# EAGLE design entity_module (EAGLE 6.3)
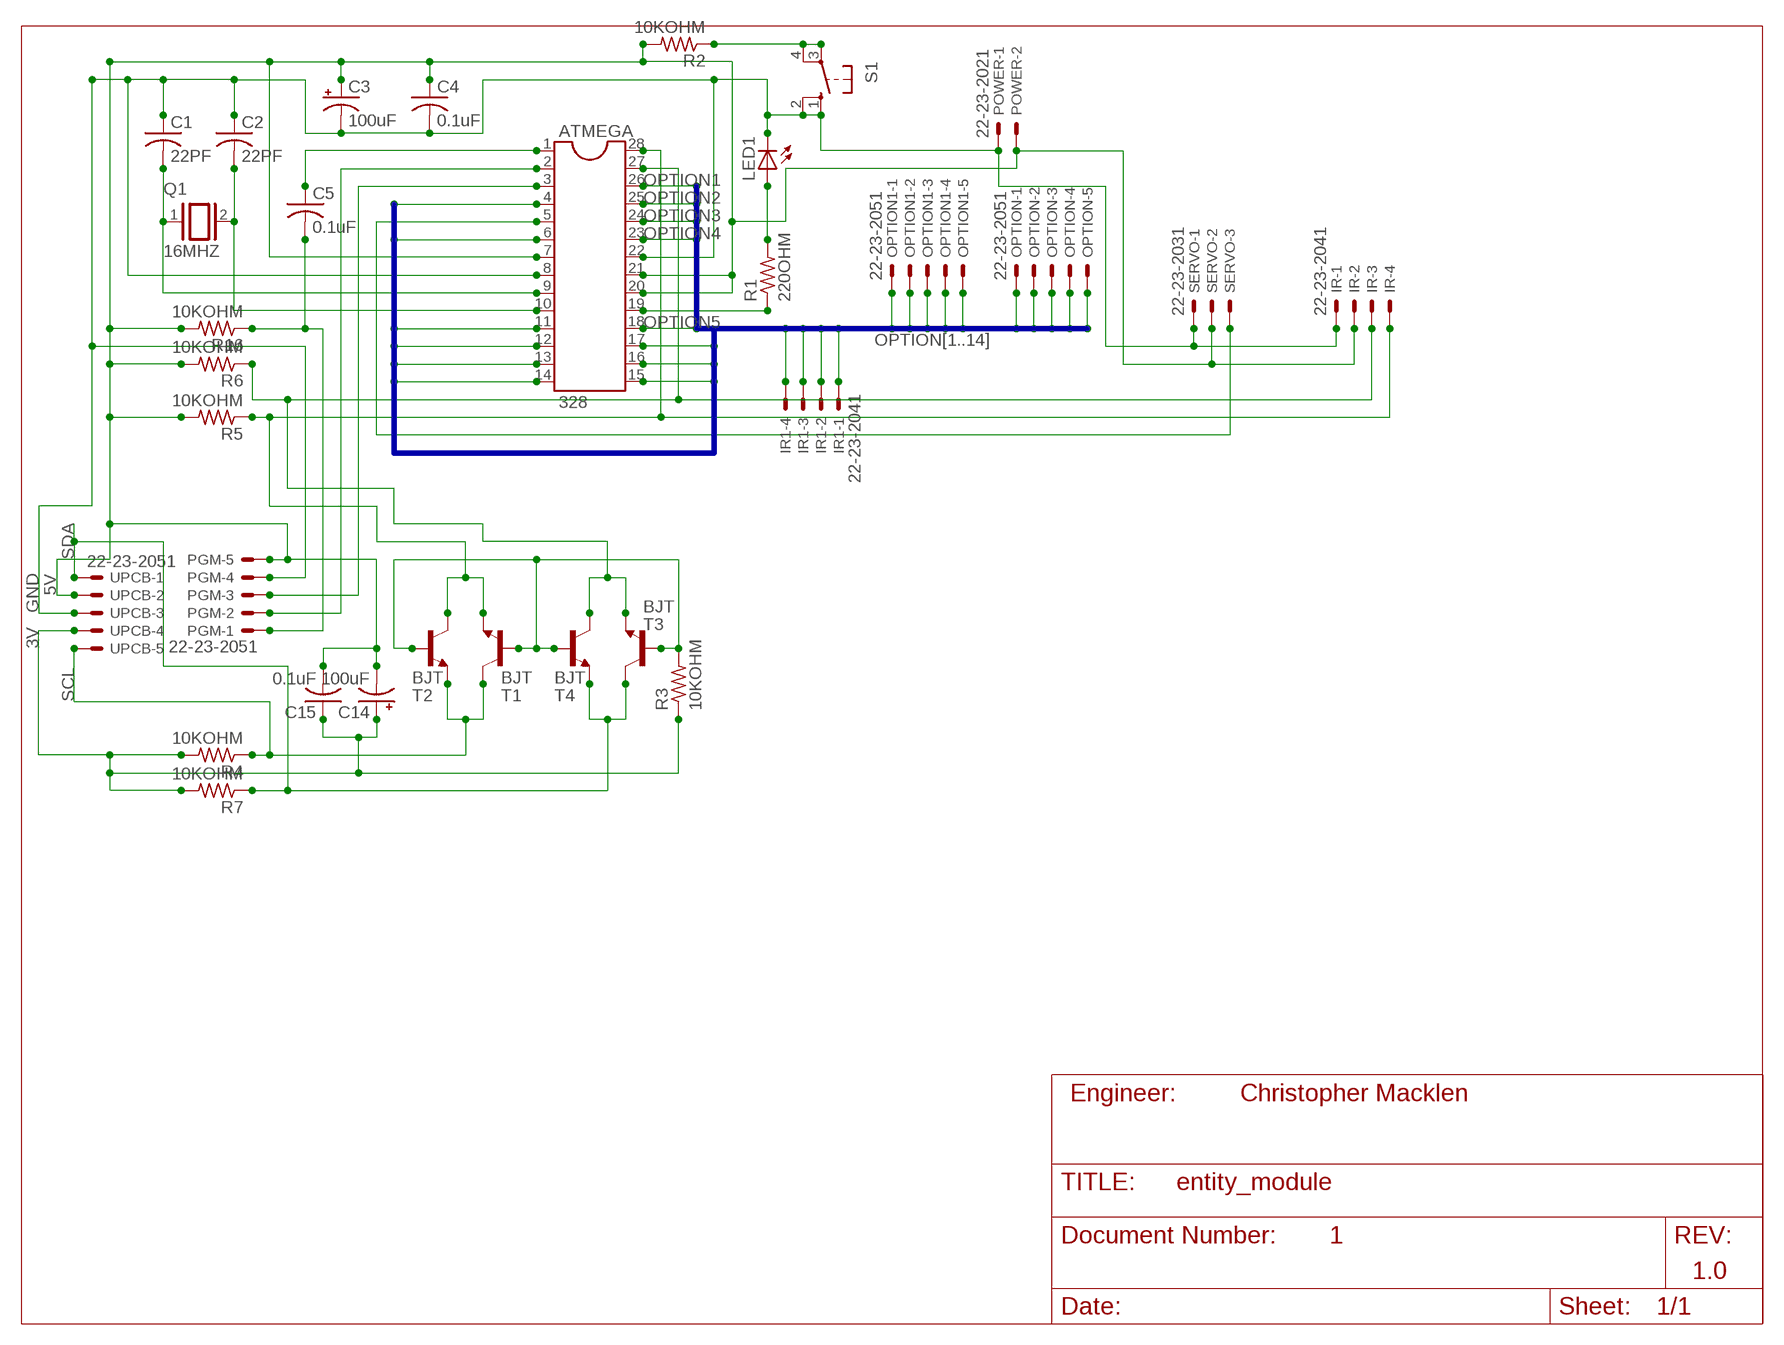
[diagram p0: schematic, sheet 1]

## Parts
ATMEGA  328  DIL28  [DIL28-6]
C1  22PF  C-US025-024X044  [C025-024X044]
C2  22PF  C-US025-024X044  [C025-024X044]
C3  100uF  CPOL-USE2-5  [E2-5]
C4  0.1uF  C-US025-024X044  [C025-024X044]
C5  0.1uF  C-US025-024X044  [C025-024X044]
C14  100uF  CPOL-USE2-5  [E2-5]
C15  0.1uF  C-US025-024X044  [C025-024X044]
IR  22-23-2041  [22-23-2041]
IR1  22-23-2041  [22-23-2041]
LED1  LED3MM  [LED3MM]
OPTION  22-23-2051  [22-23-2051]
OPTION1  22-23-2051  [22-23-2051]
PGM  22-23-2051  [22-23-2051]
POWER  22-23-2021  [22-23-2021]
Q1  16MHZ  XTAL/S  [QS]
R1  220OHM  R-US_0204/7  [0204/7]
R2  10KOHM  R-US_0204/7  [0204/7]
R3  10KOHM  R-US_0204/7  [0204/7]
R4  10KOHM  R-US_0204/7  [0204/7]
R5  10KOHM  R-US_0204/7  [0204/7]
R6  10KOHM  R-US_0204/7  [0204/7]
R7  10KOHM  R-US_0204/7  [0204/7]
R16  10KOHM  R-US_0204/7  [0204/7]
S1  10-XX  [B3F-10XX]
SERVO  22-23-2031  [22-23-2031]
T1  BJT  -NPN-TO92-E1  [TO92-E1]
T2  BJT  -NPN-TO92-E1  [TO92-E1]
T3  BJT  -NPN-TO92-E1  [TO92-E1]
T4  BJT  -NPN-TO92-E1  [TO92-E1]
UPCB  22-23-2051  [22-23-2051]

## Nets
3V: C14.+ C15.1 R3.1 R4.2 R7.2 UPCB.4
5V: ATMEGA.7 ATMEGA.20 ATMEGA.21 C3.+ C4.1 C14.- C15.2 IR.2 PGM.5 POWER.2 R2.2 R5.2 R6.2 R16.2 SERVO.2 UPCB.2
CLK-1: ATMEGA.9 C1.2 Q1.1
CLK-2: ATMEGA.10 C2.2 Q1.2
GND: ATMEGA.8 ATMEGA.22 C1.1 C2.1 C3.- C4.2 IR.1 LED1.K(C) PGM.4 POWER.1 S1.1(S) S1.2(S1) SERVO.1 UPCB.3
I2C-EN: R3.2 T1.2(B) T2.2(B) T3.2(B) T4.2(B)
LEDNET-1: ATMEGA.19 R1.1
LEDNET-2: LED1.A R1.2
N$1: ATMEGA.5 SERVO.3
OPTION1: ATMEGA.26 OPTION.1
OPTION2: ATMEGA.25 OPTION.2
OPTION3: ATMEGA.24 OPTION.3
OPTION4: ATMEGA.23 OPTION.4
OPTION5: ATMEGA.18 OPTION.5
OPTION6: ATMEGA.4 OPTION1.1
OPTION7: ATMEGA.6 OPTION1.2
OPTION8: ATMEGA.11 OPTION1.3
OPTION9: ATMEGA.12 OPTION1.4
OPTION10: ATMEGA.13 OPTION1.5
OPTION11: ATMEGA.14 IR1.1
OPTION12: ATMEGA.15 IR1.2
OPTION13: ATMEGA.16 IR1.3
OPTION14: ATMEGA.17 IR1.4
RST-1: C5.2 PGM.1 R16.1
RST-2: ATMEGA.1 C5.1
RST-SW: R2.1 S1.3(P) S1.4(P1)
RX-TX: ATMEGA.3 PGM.3
SCL: R4.1 T1.1(C) T2.3(E) UPCB.5
SCL-5V: ATMEGA.28 IR.4 R5.1 T1.3(E) T2.1(C)
SDA: R7.1 T3.1(C) T4.3(E) UPCB.1
SDA-5V: ATMEGA.27 IR.3 R6.1 T3.3(E) T4.1(C)
TX-RX: ATMEGA.2 PGM.2

## Buses
OPTION[1..14]

## Notes on the sheet
- Engineer: | Christopher Macklen
- 1
- 1.0

## Library data of the parts
ATMEGA = ic-package:DIL28: Dual In Line
C1 C2 C4 C5 C15 = rcl:C-US: CAPACITOR, American symbol
C3 C14 = rcl:CPOL-US: POLARIZED CAPACITOR, American symbol
IR IR1 = con-molex:22-23-2041: .100" (2.54mm) Center Header - 4 Pin; MF: MOLEX; MPN: 22-23-2041; OC_FARNELL: 1462920; OC_NEWARK: 38C0355
LED1 = led:LED: LED OSRAM: - CHIPLED LG R971, LG N971, LY N971, LG Q971, LY Q971, LO R971, LY R971 LH N974, LH R974 LS Q976, LO Q976, LY Q976 LO Q996 - Hyper CHIPLED LW Q18S LB Q993, LB Q99A, LB R99A - SideLED LS A670, LO A670, LY A670, LG A670, LP A670 LB A673, LV A673, LT A673, LW A673 LH A674 LY A675 LS A676, LA A676, LO A676, LY A676, LW A676 LS A679, LY A679, LG A679 - Hyper Micro SIDELED® LS Y876, LA Y876, LO Y876, LY Y876 LT Y87S - SmartLED LW L88C, LW L88S LB L89C, LB L89S, LG L890 LS L89K, LO L89K, LY L89K LS L896, LA L896, LO L896, LY L896 - TOPLED LS T670, LO T670, LY T670, LG T670, LP T670 LSG T670, LSP T670, LSY T670, LOP T670, LYG T670 LG T671, LOG T671, LSG T671 LB T673, LV T673, LT T673, LW T673 LH T674 LS T676, LA T676, LO T676, LY T676, LB T676, LH T676, LSB T676, LW T676 LB T67C, LV T67C, LT T67C, LS T67K, LO T67K, LY T67K, LW E67C LS E67B, LA E67B, LO E67B, LY E67B, LB E67C, LV E67C, LT E67C LW T67C LS T679, LY T679, LG T679 LS T770, LO T770, LY T770, LG T770, LP T770 LB T773, LV T773, LT T773, LW T773 LH T774 LS E675, LA E675, LY E675, LS T675 LS T776, LA T776, LO T776, LY T776, LB T776 LHGB T686 LT T68C, LB T68C - Hyper Mini TOPLED® LB M676 - Mini TOPLED Santana® LG M470 LS M47K, LO M47K, LY M47K Source: http://www.osram.convergy.de LUXEON: - LUMILED® LXK2-PW12-R00, LXK2-PW12-S00, LXK2-PW14-U00, LXK2-PW14-V00 LXK2-PM12-R00, LXK2-PM12-S00, LXK2-PM14-U00 LXK2-PE12-Q00, LXK2-PE12-R00, LXK2-PE12-S00, LXK2-PE14-T00, LXK2-PE14-U00 LXK2-PB12-K00, LXK2-PB12-L00, LXK2-PB12-M00, LXK2-PB14-N00, LXK2-PB14-P00, LXK2-PB14-Q00 LXK2-PR12-L00, LXK2-PR12-M00, LXK2-PR14-Q00, LXK2-PR14-R00 LXK2-PD12-Q00, LXK2-PD12-R00, LXK2-PD12-S00 LXK2-PH12-R00, LXK2-PH12-S00 LXK2-PL12-P00, LXK2-PL12-Q00, LXK2-PL12-R00 Source: www.luxeon.com KINGBRIGHT: KA-3528ASYC Source: www.kingbright.com
OPTION OPTION1 PGM UPCB = con-molex:22-23-2051: .100" (2.54mm) Center Header - 5 Pin; MF: MOLEX; MPN: 22-23-2051; OC_FARNELL: 1462952; OC_NEWARK: 38C9178
POWER = con-molex:22-23-2021: .100" (2.54mm) Center Header - 2 Pin; MF: MOLEX; MPN: 22-23-2021; OC_FARNELL: 1462926; OC_NEWARK: 25C3832
Q1 = special:XTAL/S: CRYSTAL
R1-R7 R16 = rcl:R-US_: RESISTOR, American symbol
S1 = switch-omron:10-XX: OMRON SWITCH; MPN: B3F-1000; OC_FARNELL: 176432; OC_NEWARK: 36M3542
SERVO = con-molex:22-23-2031: .100" (2.54mm) Center Header - 3 Pin; MF: MOLEX; MPN: 22-23-2031; OC_FARNELL: 1462950; OC_NEWARK: 30C0862
T1-T4 = transistor:*-NPN-: NPN Transistror BF959 corrected 2008.03.06

## Board
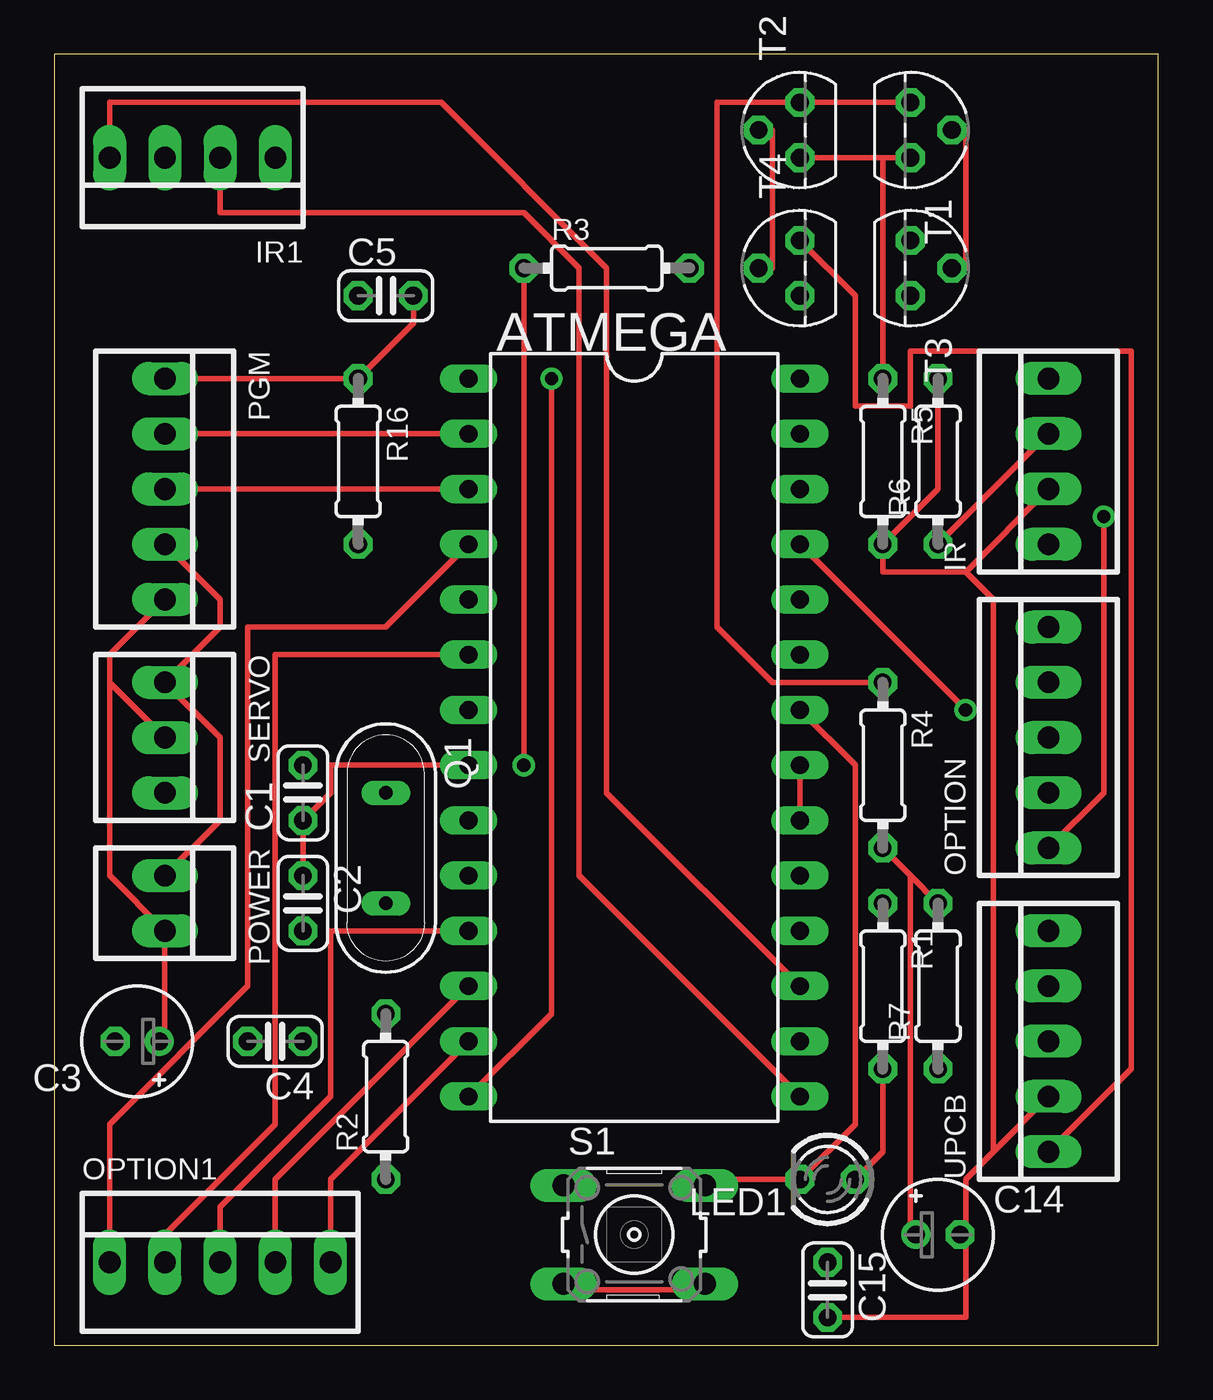
[diagram p1: board, top side]
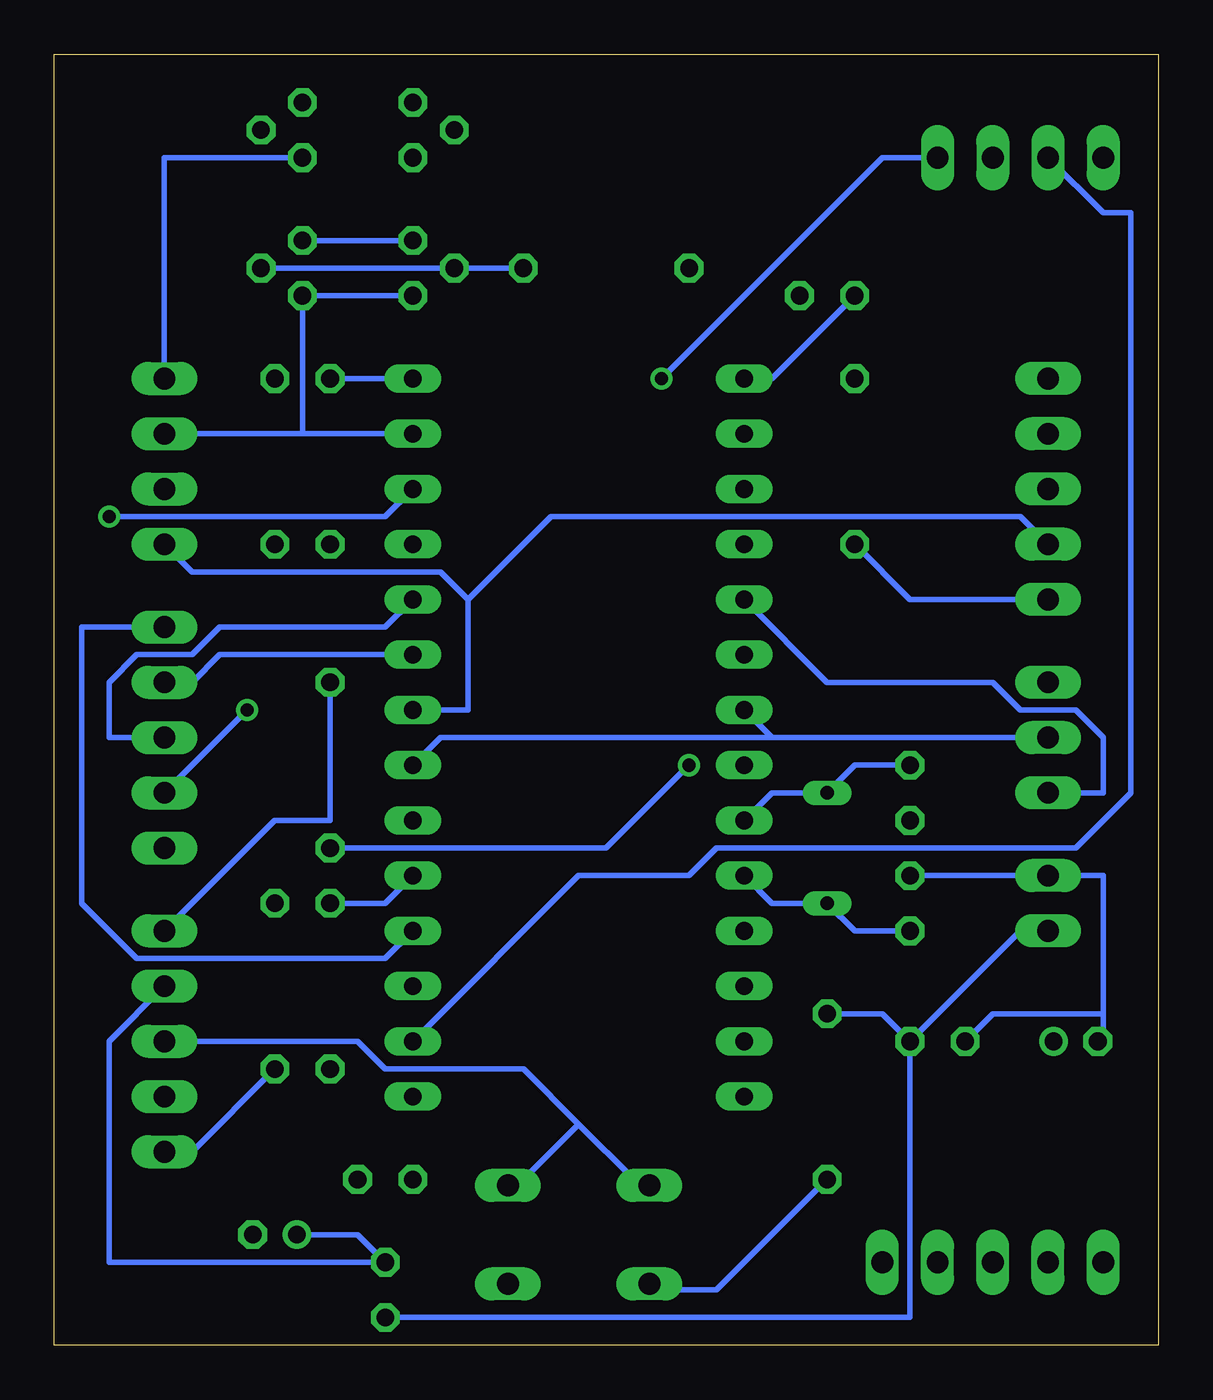
[diagram p2: board, bottom side, seen from below]

Size 50.78 x 59.36 mm. Coordinates in mm from the lower left corner, seen from the top.
Outline: 0,0 50.78,0 50.78,59.36 0,59.36 0,0
Copper layers (1*16): Top 0.035mm / dielectric 1.5mm / Bottom 0.035mm
Design rules "default": minimum track width 10mil, minimum drill 24mil, track to track 8mil, track to pad 8mil, pad to pad 8mil, via to via 8mil, smd to smd 8mil, copper to edge 40mil, drill to drill 8mil, minimum pad ring 10mil, minimum via ring 8mil, stop-mask expansion 4mil, vias tented up to drill 0mil, thermal gap 10mil

### Footprints (pad centres in the part's own frame; a part is rotated, then mirrored left to right if it is on the bottom)
DIL28-6 = drill 0.813 long: 1 -16.51,-7.62; 2 -13.97,-7.62; 3 -11.43,-7.62; 4 -8.89,-7.62; 5 -6.35,-7.62; 6 -3.81,-7.62; 7 -1.27,-7.62; 8 1.27,-7.62; 9 3.81,-7.62; 10 6.35,-7.62; 11 8.89,-7.62; 12 11.43,-7.62; 13 13.97,-7.62; 14 16.51,-7.62; 15 16.51,7.62; 16 13.97,7.62; 17 11.43,7.62; 18 8.89,7.62; 19 6.35,7.62; 20 3.81,7.62; 21 1.27,7.62; 22 -1.27,7.62; 23 -3.81,7.62; 24 -6.35,7.62; 25 -8.89,7.62; 26 -11.43,7.62; 27 -13.97,7.62; 28 -16.51,7.62
C025-024X044 = drill 0.813 octagon: 1 -1.27,0; 2 1.27,0
E2-5 = drill 0.813 pad 1.27: + -1.016,0 | drill 0.813 pad 1.27 octagon: - 1.016,0
22-23-2041 = drill 1 long: 1 -3.81,0; 2 -1.27,0; 3 1.27,0; 4 3.81,0
LED3MM = drill 0.813 octagon: A -1.27,0; K 1.27,0
22-23-2051 = drill 1 long: 1 -5.08,0; 2 -2.54,0; 3 0,0; 4 2.54,0; 5 5.08,0
22-23-2021 = drill 1 long: 1 -1.27,0; 2 1.27,0
QS = drill 0.61 long: 1 -2.54,0; 2 2.54,0
0204/7 = drill 0.813 octagon: 1 -3.81,0; 2 3.81,0
B3F-10XX = drill 1.016 long: 1 -3.251,2.261; 2 3.251,2.261; 3 -3.251,-2.261; 4 3.251,-2.261
22-23-2031 = drill 1 long: 1 -2.54,0; 2 0,0; 3 2.54,0
TO92-E1 = drill 0.813 octagon: 1 -1.27,0; 2 0,1.905; 3 1.27,0

### Placement (x,y rotation side)
ATMEGA  26.67,27.94 270 top
C1  11.43,25.4 90 top
C2  11.43,20.32 270 top
C3  3.81,13.97 180 top
C4  10.16,13.97 180 top
C5  15.24,48.26 0 top
C14  40.64,5.08 0 top
C15  35.56,2.54 270 top
IR  45.72,40.64 90 top
IR1  6.35,54.61 180 top
LED1  35.56,7.62 180 top
OPTION  45.72,27.94 90 top
OPTION1  7.62,3.81 0 top
PGM  5.08,39.37 270 top
POWER  5.08,20.32 270 top
Q1  15.24,22.86 270 top
R1  38.1,16.51 270 top
R2  15.24,11.43 90 top
R3  25.4,49.53 0 top
R4  38.1,26.67 270 top
R5  38.1,40.64 270 top
R6  40.64,40.64 90 top
R7  40.64,16.51 90 top
R16  13.97,40.64 270 top
S1  26.67,5.08 0 top
SERVO  5.08,27.94 270 top
T1  39.37,55.88 270 top
T2  34.29,55.88 90 top
T3  39.37,49.53 270 top
T4  34.29,49.53 90 top
UPCB  45.72,13.97 90 top

### Tracks (layer width: path | path; a pad name or v marks a point on that pad's centre or on a via)
3V  (via drill 0.61)
  Top 0.254: R4.2 39.37,21.59 | 39.37,21.59 R7.2 | v21.59,26.67 R3.1 | 39.37,21.59 39.37,5.08 C14.+
  Bottom 0.254: C14.+ 36.83,5.08 C15.1 48.26,3.81 48.26,13.97 UPCB.4 | v21.59,26.67 25.4,22.86 R4.2
5V
  Top 0.254: C3.+ 5.08,13.97 POWER.2 2.54,21.59 2.54,30.48 | ATMEGA.21 ATMEGA.20 | PGM.5 2.54,31.75 2.54,30.48 | SERVO.2 2.54,30.48 | R6.2 40.64,39.37 R5.2 38.1,35.56 41.91,35.56 | 41.91,35.56 IR.2 | C15.2 41.91,1.27 41.91,5.08 | 43.18,8.89 41.91,7.62 41.91,5.08 | 43.18,8.89 UPCB.2 | 41.91,5.08 C14.- | 41.91,35.56 43.18,34.29 43.18,8.89
  Bottom 0.254: C4.1 12.7,15.24 R2.2 | C4.1 6.35,19.05 POWER.2 | R16.2 11.43,34.29 PGM.5 | 17.78,27.94 ATMEGA.7 | SERVO.2 17.78,27.94 | ATMEGA.21 33.02,27.94 17.78,27.94 | C4.1 11.43,1.27 C15.2
CLK-1
  Bottom 0.254: C1.2 13.97,26.67 Q1.1 17.78,25.4 ATMEGA.9
CLK-2
  Bottom 0.254: C2.2 13.97,19.05 Q1.2 17.78,20.32 ATMEGA.10
GND
  Top 0.254: C2.1 C1.1 12.7,25.4 12.7,26.67 ATMEGA.8 | PGM.4 7.62,34.29 7.62,33.02 SERVO.1 7.62,27.94 7.62,24.13 POWER.1 | S1.2 30.48,7.62 LED1.K 36.83,10.16 36.83,26.67 ATMEGA.22
  Bottom 0.254: 2.54,15.24 2.54,21.59 POWER.1 C2.1 | 2.54,15.24 2.54,13.97 C3.- | C4.2 7.62,15.24 2.54,15.24 | UPCB.3 36.83,13.97 35.56,12.7 29.21,12.7 26.67,10.16 | 26.67,10.16 24.13,7.62 S1.1 | IR.1 44.45,35.56 33.02,35.56 31.75,34.29 | 31.75,34.29 31.75,29.21 ATMEGA.22 | 26.67,10.16 29.21,7.62 S1.2 | PGM.4 6.35,38.1 27.94,38.1 31.75,34.29
I2C-EN
  Top 0.254: T3.2 41.91,49.53 41.91,55.88 T1.2 | T2.2 33.02,55.88 33.02,49.53 T4.2
  Bottom 0.254: R3.2 T4.2 T3.2
LEDNET-1
  Bottom 0.254: ATMEGA.19 35.56,20.32 R1.1
LEDNET-2
  Top 0.254: LED1.A 38.1,8.89 R1.2
N$1
  Bottom 0.254: ATMEGA.5 15.24,30.48 7.62,30.48 6.35,29.21 3.81,29.21 2.54,27.94 2.54,25.4 SERVO.3
OPTION1  (via drill 0.61)
  Top 0.254: v48.26,38.1 48.26,25.4 OPTION.1
  Bottom 0.254: ATMEGA.26 35.56,38.1 v48.26,38.1
OPTION2  (via drill 0.61)
  Top 0.254: v41.91,29.21 ATMEGA.25
  Bottom 0.254: OPTION.2 v41.91,29.21
OPTION3
  Bottom 0.254: ATMEGA.24 35.56,33.02 43.18,33.02 44.45,31.75 46.99,31.75 48.26,30.48 48.26,27.94 OPTION.3
OPTION4
  Bottom 0.254: ATMEGA.23 43.18,31.75 44.45,30.48 OPTION.4
OPTION5
  Bottom 0.254: ATMEGA.18 35.56,17.78 46.99,17.78 49.53,20.32 49.53,33.02 OPTION.5
OPTION6
  Top 0.254: ATMEGA.4 15.24,33.02 8.89,33.02 8.89,16.51 2.54,10.16 OPTION1.1
OPTION7
  Top 0.254: ATMEGA.6 10.16,31.75 10.16,10.16 5.08,5.08 OPTION1.2
OPTION8
  Top 0.254: ATMEGA.11 12.7,19.05 12.7,11.43 7.62,6.35 OPTION1.3
OPTION9
  Top 0.254: ATMEGA.12 10.16,7.62 OPTION1.4
OPTION10
  Top 0.254: ATMEGA.13 12.7,7.62 OPTION1.5
OPTION11  (via drill 0.61)
  Top 0.254: ATMEGA.14 22.86,15.24 v22.86,44.45
  Bottom 0.254: v22.86,44.45 12.7,54.61 IR1.1
OPTION12
  Top 0.254: ATMEGA.15 24.13,21.59 24.13,49.53 21.59,52.07 7.62,52.07 IR1.2
OPTION13
  Bottom 0.254: ATMEGA.16 26.67,21.59 21.59,21.59 20.32,22.86 3.81,22.86 1.27,25.4 1.27,52.07 2.54,52.07 IR1.3
OPTION14
  Top 0.254: ATMEGA.17 25.4,25.4 25.4,49.53 17.78,57.15 2.54,57.15 IR1.4
RST-1
  Top 0.254: C5.2 16.51,46.99 R16.1 PGM.1
RST-2
  Bottom 0.254: C5.1 17.78,44.45 ATMEGA.1
RST-SW
  Top 0.254: S1.4 29.21,2.54 24.13,2.54 S1.3
  Bottom 0.254: R2.1 20.32,2.54 22.86,2.54 S1.3
RX-TX
  Top 0.254: PGM.3 ATMEGA.3
SCL
  Top 0.254: T1.1 T2.3 30.48,57.15 30.48,33.02 33.02,30.48 R4.1
  Bottom 0.254: R4.1 38.1,24.13 40.64,24.13 UPCB.5
SCL-5V
  Top 0.254: T1.3 38.1,54.61 | 38.1,54.61 T2.1 | 38.1,54.61 R5.1
  Bottom 0.254: R5.1 ATMEGA.28 | IR.4 45.72,54.61 T1.3
SDA
  Top 0.254: T4.3 36.83,48.26 36.83,43.18 39.37,43.18 39.37,45.72 49.53,45.72 49.53,12.7 UPCB.1
  Bottom 0.254: T3.1 T4.3 | R7.1 44.45,8.89 UPCB.1
SDA-5V
  Top 0.254: IR.3 R6.1
  Bottom 0.254: T4.1 T3.3 39.37,41.91 | IR.3 39.37,41.91 | 39.37,41.91 ATMEGA.27
TX-RX
  Top 0.254: PGM.2 ATMEGA.2